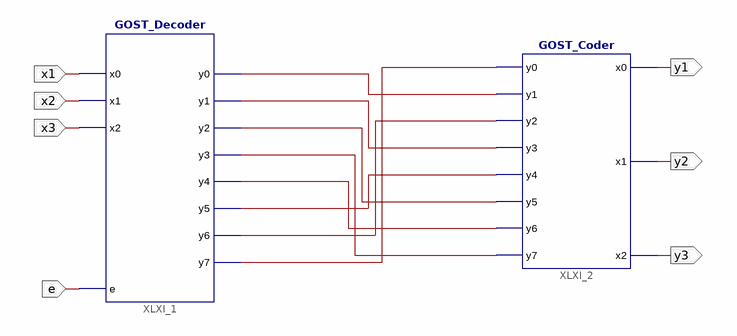
[diagram p0: schematic sheet 1]
// Xilinx ISE schematic Sboxgostscheme.sch (kintex7) as structural Verilog: 2 symbols, 7 ports
module Sboxgostscheme (
  input  x3,
  input  x2,
  input  x1,
  input  e,
  output y3,
  output y2,
  output y1
);

  wire XLXN_1, XLXN_2, XLXN_3, XLXN_4, XLXN_5, XLXN_6, XLXN_7, XLXN_8;

  GOST_Decoder XLXI_1 (
    .x0(x1), .x1(x2), .x2(x3), .e(e), .y0(XLXN_1), .y1(XLXN_2), .y2(XLXN_3), .y3(XLXN_4), .y4(XLXN_5),
    .y5(XLXN_6), .y6(XLXN_7), .y7(XLXN_8));
  GOST_Coder XLXI_2 (
    .y0(XLXN_8), .y1(XLXN_1), .y2(XLXN_7), .y3(XLXN_2), .y4(XLXN_6), .y5(XLXN_3), .y6(XLXN_5), .y7(XLXN_4),
    .x0(y1), .x1(y2), .x2(y3));
endmodule
